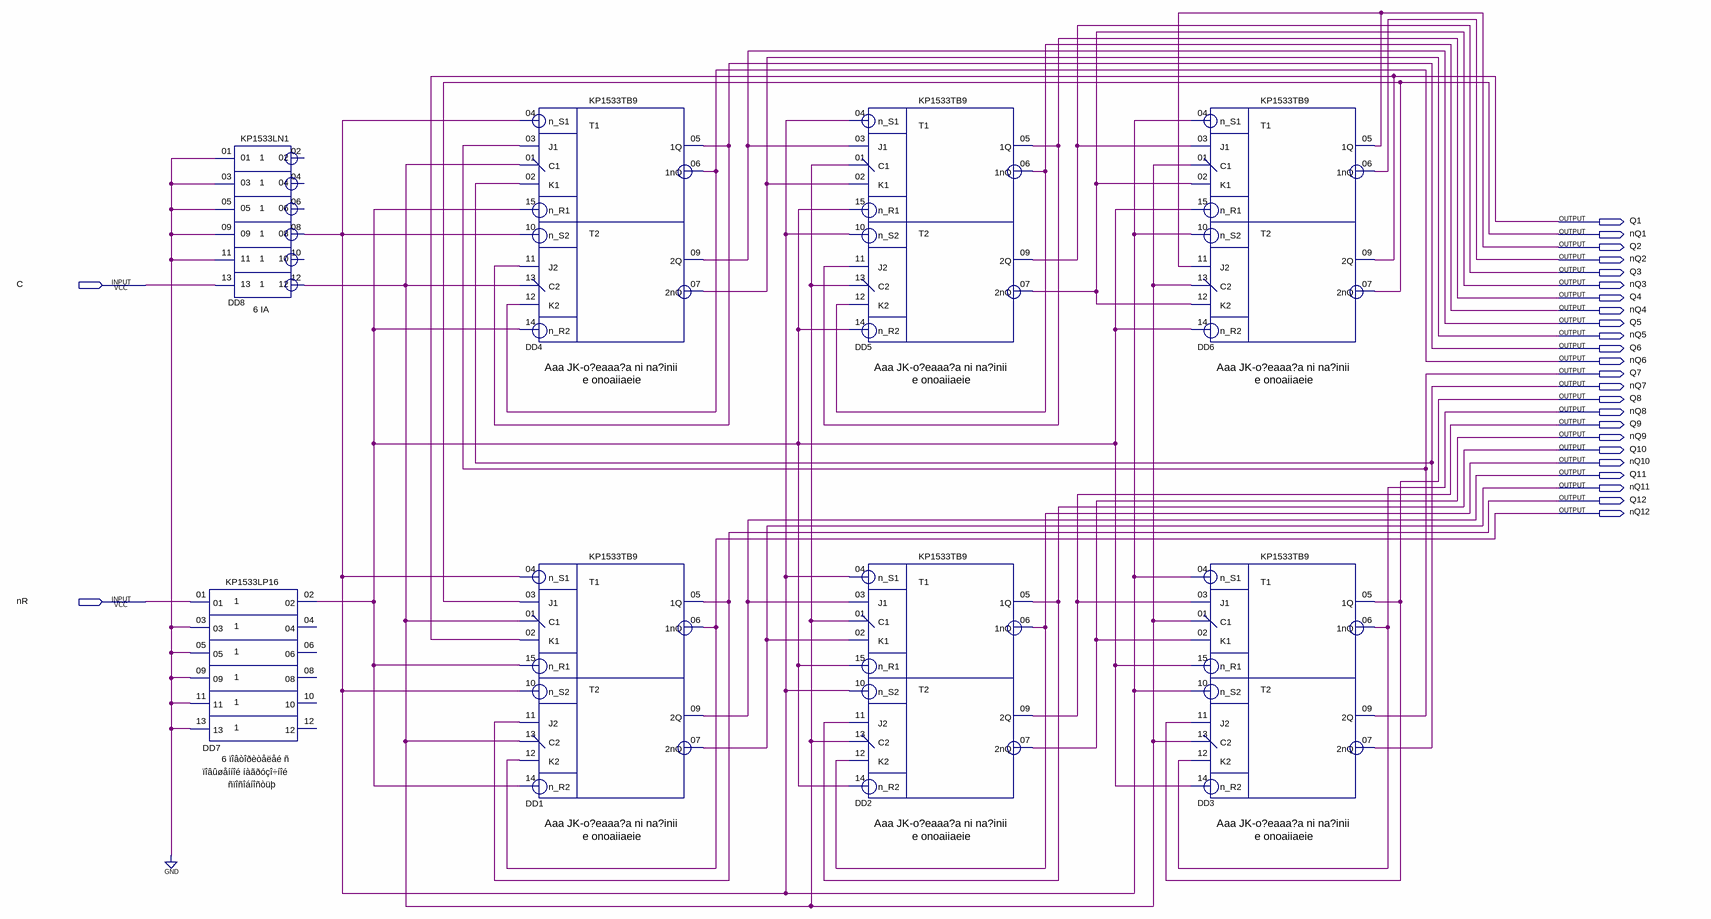
[diagram p0: schematic sheet]
// Quartus schematic _JohnsonCounterJKFF.bdf as structural Verilog: 8 symbols, 26 pins
module _JohnsonCounterJKFF (
  input  C,
  input  nR,
  output Q1,
  output nQ1,
  output Q2,
  output nQ2,
  output Q3,
  output nQ3,
  output Q4,
  output nQ4,
  output Q5,
  output nQ5,
  output Q6,
  output nQ6,
  output Q7,
  output nQ7,
  output Q8,
  output nQ8,
  output Q9,
  output nQ9,
  output Q10,
  output nQ10,
  output Q11,
  output nQ11,
  output Q12,
  output nQ12
);

  wire DD7_02, DD8_08, DD8_12;

  KP1533LN1 DD8 (
    .\01 (1'b0), .\03 (1'b0), .\05 (1'b0), .\09 (1'b0), .\11 (1'b0), .\13 (C), .\08 (DD8_08), .\12 (DD8_12));  // open: 02, 04, 06, 10
  KP1533LP16 DD7 (
    .\01 (nR), .\03 (1'b0), .\05 (1'b0), .\09 (1'b0), .\11 (1'b0), .\13 (1'b0), .\02 (DD7_02));  // open: 04, 06, 08, 10, 12
  KP1533TB9 DD4 (
    .n_S1(DD8_08), .J1(Q7), .n_R1(DD7_02), .C1(DD8_12), .K1(nQ7), .n_S2(DD8_08), .J2(Q6), .n_R2(DD7_02),
    .C2(DD8_12), .K2(nQ6), .\1Q (Q6), .\1nQ (nQ6), .\2Q (Q5), .\2nQ (nQ5));
  KP1533TB9 DD1 (
    .n_S1(DD8_08), .J1(nQ1), .n_R1(DD7_02), .C1(DD8_12), .K1(Q1), .n_S2(DD8_08), .J2(Q12), .n_R2(DD7_02),
    .C2(DD8_12), .K2(nQ12), .\1Q (Q12), .\1nQ (nQ12), .\2Q (Q11), .\2nQ (nQ11));
  KP1533TB9 DD5 (
    .n_S1(DD8_08), .J1(Q5), .n_R1(DD7_02), .C1(DD8_12), .K1(nQ5), .n_S2(DD8_08), .J2(Q4), .n_R2(DD7_02),
    .C2(DD8_12), .K2(nQ4), .\1Q (Q4), .\1nQ (nQ4), .\2Q (Q3), .\2nQ (nQ3));
  KP1533TB9 DD2 (
    .n_S1(DD8_08), .J1(Q11), .n_R1(DD7_02), .C1(DD8_12), .K1(nQ11), .n_S2(DD8_08), .J2(Q10), .n_R2(DD7_02),
    .C2(DD8_12), .K2(nQ10), .\1Q (Q10), .\1nQ (nQ10), .\2Q (Q9), .\2nQ (nQ9));
  KP1533TB9 DD6 (
    .n_S1(DD8_08), .J1(Q3), .n_R1(DD7_02), .C1(DD8_12), .K1(nQ3), .n_S2(DD8_08), .J2(Q2), .n_R2(DD7_02),
    .C2(DD8_12), .K2(nQ3), .\1Q (Q2), .\1nQ (nQ2), .\2Q (Q1), .\2nQ (nQ1));
  KP1533TB9 DD3 (
    .n_S1(DD8_08), .J1(Q9), .n_R1(DD7_02), .C1(DD8_12), .K1(nQ9), .n_S2(DD8_08), .J2(Q8), .n_R2(DD7_02),
    .C2(DD8_12), .K2(nQ8), .\1Q (Q8), .\1nQ (nQ8), .\2Q (Q7), .\2nQ (nQ7));
endmodule
